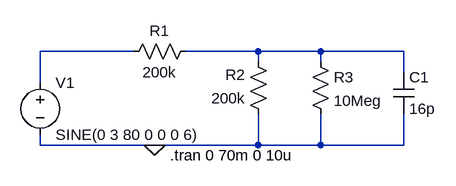
[diagram p0: schematic Exp2part3.asc]
Exp2part3.asc, the LTspice schematic file:
Version 4
SHEET 1 880 680
WIRE 128 80 -16 80
WIRE 320 80 208 80
WIRE 416 80 320 80
WIRE 544 80 416 80
WIRE 320 96 320 80
WIRE 416 96 416 80
WIRE 544 112 544 80
WIRE -16 128 -16 80
WIRE -16 224 -16 208
WIRE 160 224 -16 224
WIRE 320 224 320 176
WIRE 320 224 160 224
WIRE 416 224 416 176
WIRE 416 224 320 224
WIRE 544 224 544 176
WIRE 544 224 416 224
FLAG 160 224 0
SYMBOL voltage -16 112 R0
WINDOW 123 0 0 Left 0
WINDOW 39 0 0 Left 0
SYMATTR InstName V1
SYMATTR Value SINE(0 3 80 0 0 0 6)
SYMBOL res 224 64 R90
WINDOW 0 0 56 VBottom 2
WINDOW 3 32 56 VTop 2
SYMATTR InstName R1
SYMATTR Value 200k
SYMBOL res 336 192 R180
WINDOW 0 36 76 Left 2
WINDOW 3 36 40 Left 2
SYMATTR InstName R2
SYMATTR Value 200k
SYMBOL res 400 80 R0
SYMATTR InstName R3
SYMATTR Value 10Meg
SYMBOL cap 528 112 R0
SYMATTR InstName C1
SYMATTR Value 16p
TEXT 184 240 Left 2 !.tran 0 70m 0 10u

The netlist it stands for:
* Exp2part3.asc
V1 N001 0 SINE(0 3 80 0 0 0 6)
R1 N002 N001 200k
R2 0 N002 200k
R3 N002 0 10Meg
C1 N002 0 16p
.tran 0 70m 0 10u
.backanno
.end